# Altium schematic sheet RS485.SchDoc: NH Speaker Sensor 16CH 2.3_C
size A3; Revision: 2.3; SheetNumber: 3; SheetTotal: 6
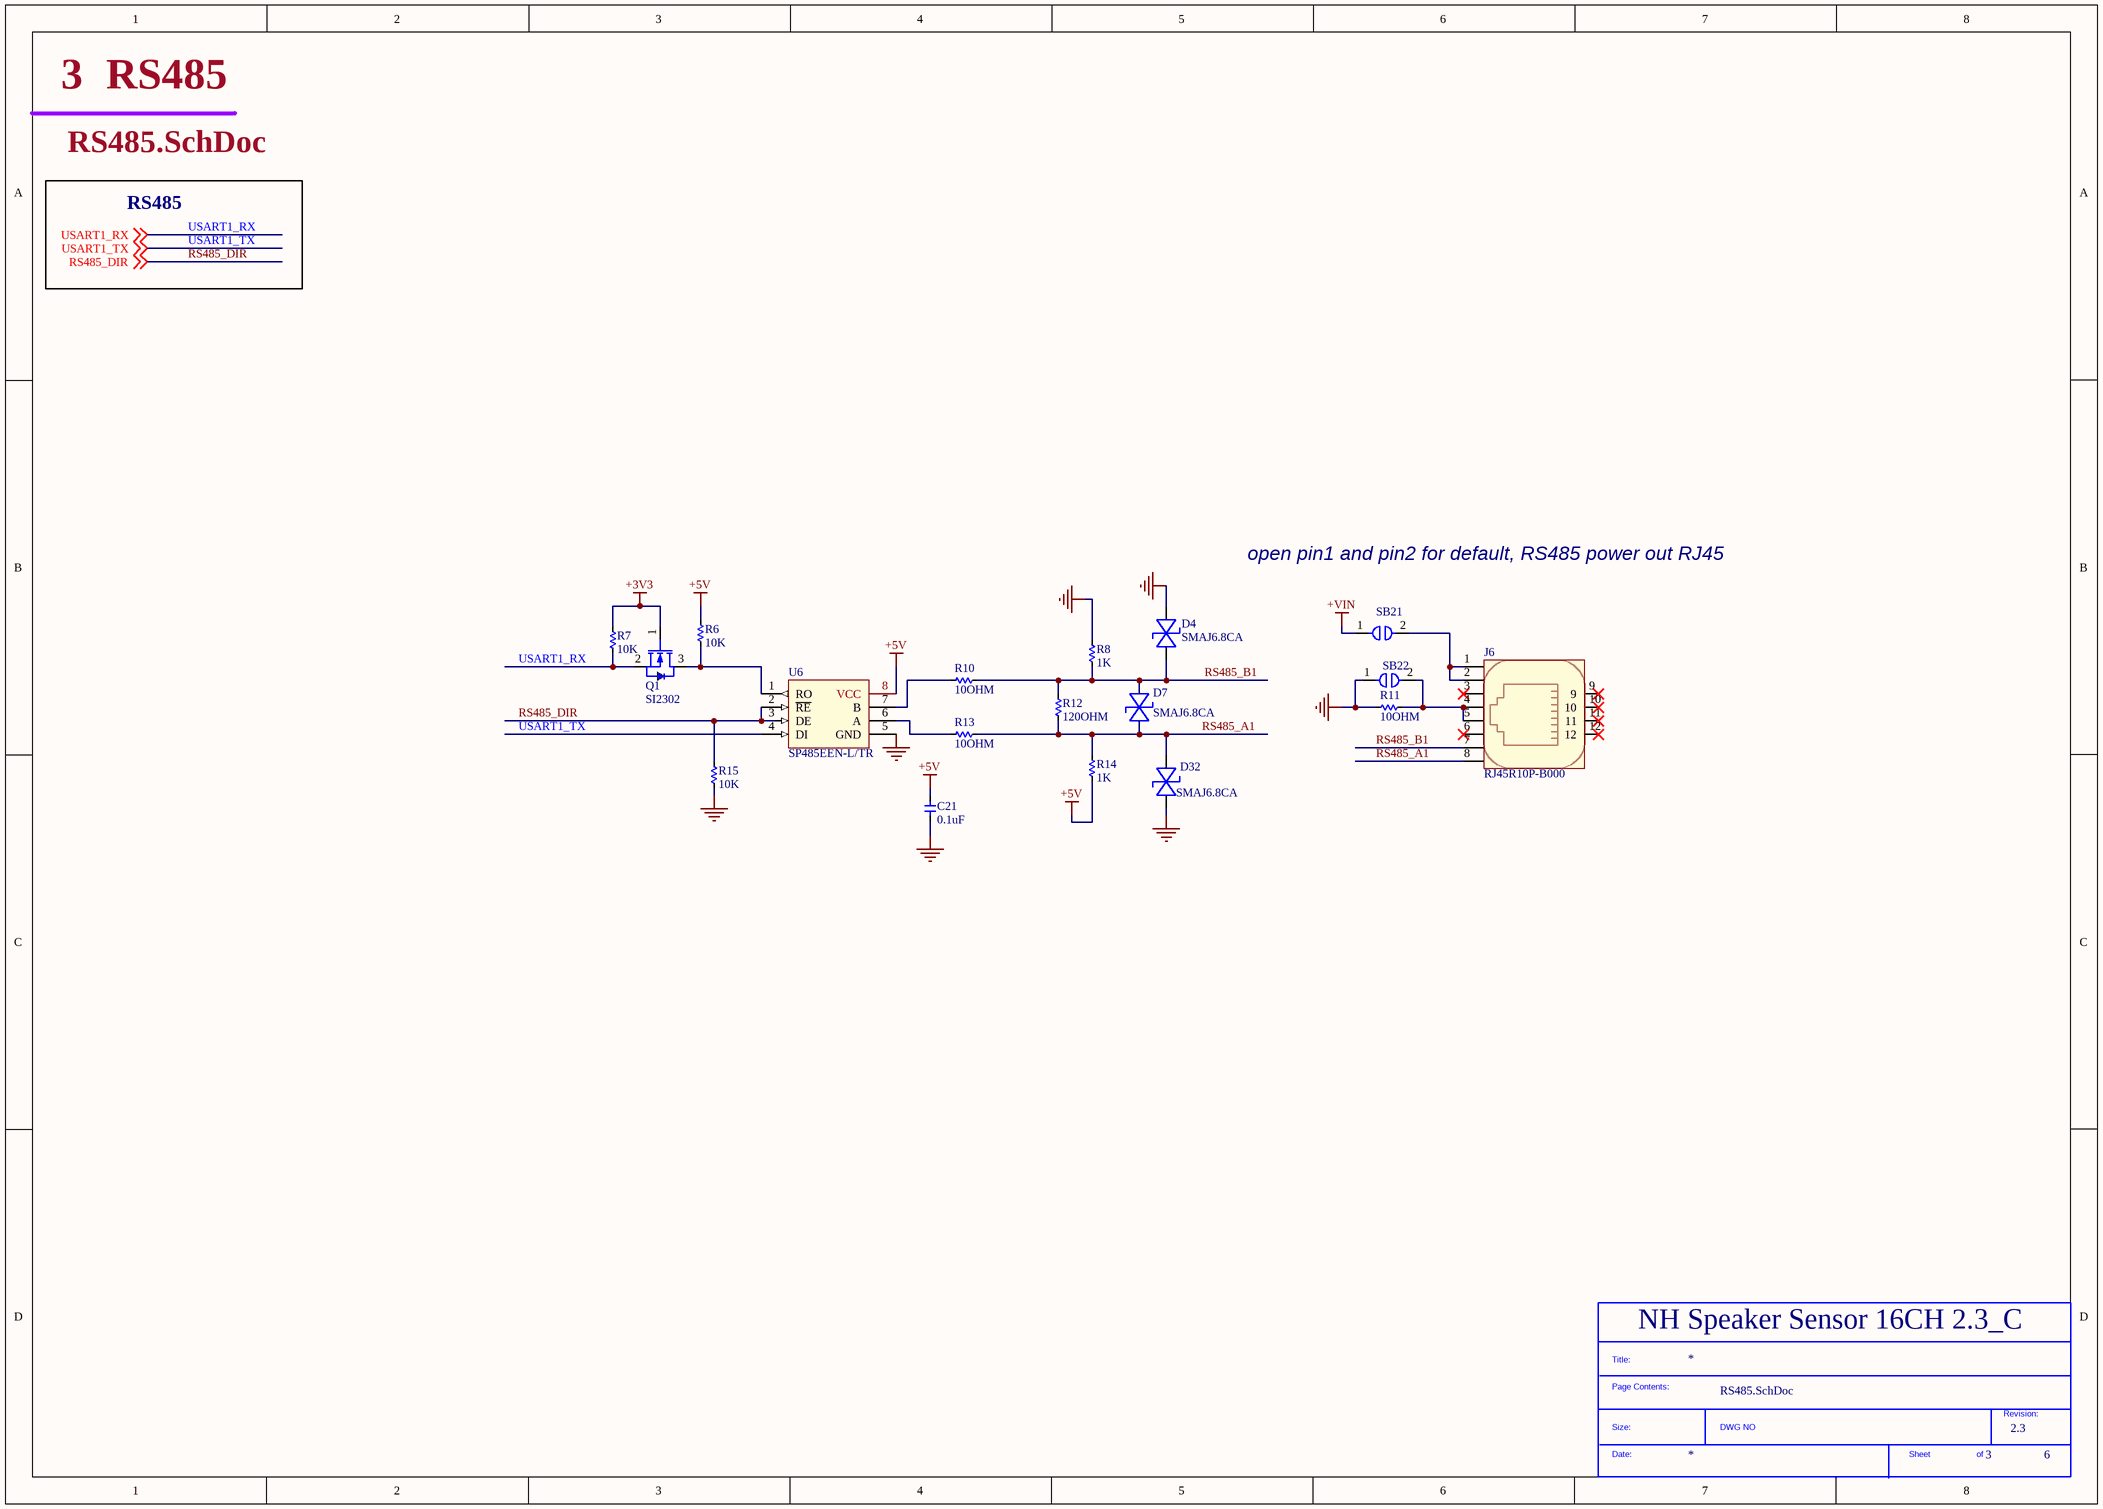
[diagram p0: RS485.SchDoc]

## Parts
*?  SDTitleBlock  (value not drawn)  (graphical)
C21  0.1uF  [C_0603]
D4  SMAJ6.8CA  [SMA,DO-214AC - CA]
D7  SMAJ6.8CA  [SMA,DO-214AC - CA]
D32  SMAJ6.8CA  [SMA,DO-214AC - CA]
J6  RJ45R10P-B000  [RJ45-TH_R-RJ45R10P-B000]
Q1  SI2302  [SOT-23-3_L2.9-W1.6-P1.90-LS2.8-BR]
R6  10K  [R_0603]
R7  10K  [R_0603]
R8  1K  [R_0603]
R10  10OHM  [R_0805]
R11  10OHM  [R_0603]
R12  120OHM  [R_0603]
R13  10OHM  [R_0805]
R14  1K  [R_0603]
R15  10K  [R_0603]
SB21  SOLDERJUMPER_1WAY  [SOLDERJUMPER_1WAY]  (value not drawn)  (no BOM)
SB22  SOLDERJUMPER_1WAY  [SOLDERJUMPER_1WAY]  (value not drawn)  (no BOM)
U6  SP485EEN-L/TR  [SOIC-8_3.9x4.9x1.27P]

## Nets
+3V3: Q1.1(G) R7.1
+5V: C21.2 R6.1 R14.2 U6.8(VCC)
+VIN: SB21.1
GND: C21.1 D4.1(A) D32.2(K) R8.1 R11.2 R15.2 SB22.1 U6.5(GND)
RS485_A1: D7.2(K) D32.1(A) J6.8 R12.2 R13.1 R14.1
RS485_B1: D4.2(K) D7.1(A) J6.7 R8.2 R10.1 R12.1
RS485_DIR: R15.1 U6.2(~{RE}) U6.3(DE) ; off-sheet RS485_DIR
USART1_RX: Q1.2(S) R7.2 ; off-sheet USART1_RX
USART1_TX: U6.4(DI) ; off-sheet USART1_TX
NetJ6_1: J6.1 J6.2 SB21.2
NetJ6_4: J6.4 J6.5 R11.1 SB22.2
NetQ1_3: Q1.3(D) R6.2 U6.1(RO)
NetR10_2: R10.2 U6.7(B)
NetR13_2: R13.2 U6.6(A)

Not connected (* = marked no-connect by the designer): J6 3* 6* 9* 10* 11* 12*

## Notes on the sheet
- RS485
- open pin1 and pin2 for default, RS485 power out RJ45
- (in symbol SDTitleBlock) Title:; Page Contents:; Revision:; Size:; DWG NO; Date:; Sheet; of

## Library data of the parts
*? = SDTitleBlock: TitleBlock
C21 = CC0603KRX7R9BB104: 100NF 50V 0603 ROHS; Manufacturer: YAGEO; Manufacturer Part Number: CC0603KRX7R9BB104; Package: 0603; LCSC Part Number: C14663; ComponentLink1Description: Digikey Link; ComponentLink1URL: https://www.digikey.com/en/products/detail/yageo/CC0603KRX7R9BB104/2103082?s=N4IgTCBcDaIMwEYEFoFwCzuWZA5AIiALoC%2BQA; ComponentLink2Description: LCSC Link; ComponentLink2URL: https://jlcpcb.com/parts/componentSearch?searchTxt=10k%200603; Assembly type: SMT Assembly
D4 D7 D32 = SMAJ6.8CA: Bidirectional 6.8V SMA(DO-214AC) TVS RoHS; Manufacturer: Bourne Semicon (Shenzhen); Manufacturer Part Number: SMAJ6.8CA; LCSC Part Number: C406209; Package: SMA,DO-214AC; Assembly Type: SMT Assembly
J6 = RJ45R10P-B000: RJ45 18MM, No Transformer; Manufacturer: Ckmtw(Shenzhen Cankemeng); Manufacturer Part Number: R-RJ45R10P-B000; LCSC Part Number: C386758; Package: Through hole; Assembly Type: Hand Soldering
Q1 = Si2302CDS-T1-GE3: MOSFET N TRENCH 20V 2.9A 850MV @ 250UA 57 M? @ 3.6A,4.5V SOT-23(SOT-23-3) ROHS; Manufacturer: Vishay Intertech; Manufacturer Part Number: Si2302CDS-T1-GE3; LCSC Part Number: C10488; Package: SOT-23-3; Assembly Type: SMT Assembly
R6 R7 R15 = 0603WAF1002T5E: 10KOHMS ±1% 1/10W 0603 ROHS; Manufacturer: Uniroyal Elec; Manufacturer Part Number: 0603WAF1002T5E; LCSC Part Number: C25804; Package: 0603; Assembly Type: SMT Assembly
R8 R14 = 0603WAF1001T5E: 1KOHMS ±1% 1/10W 0603 ROHS; Manufacturer: Uniroyal Elec; Manufacturer Part Number: 0603WAF1001T5E; LCSC Part Number: C21190; Package: 0603; Assembly Type: SMT Assembly
R10 R13 = 0805W8F100JT5E: 10OHMS ±1% 1/8W 0805 ROHS; Manufacturer: Uniroyal Elec; Manufacturer Part Number: 0805W8F100JT5E; LCSC Part Number: C17415; Package: 0805; Assembly Type: SMT Assembly
R11 = 0603WAF100JT5E: 10OHMS ±1% 1/10W 0603 ROHS; Manufacturer: Uniroyal Elec; Manufacturer Part Number: 0603WAF100JT5E; LCSC Part Number: C22859; Package: 0603; Assembly Type: SMT Assembly
R12 = 0603WAF1200T5E: 120OHMS ±1% 1/10W 0603 ROHS; Manufacturer: Uniroyal Elec; Manufacturer Part Number: 0603WAF1200T5E; Package: 0603; LCSC Part Number: C22787; Assembly Type: SMT Assembly
SB21 SB22 = SOLDERJUMPER_1WAY: GateName_1: G$1; SymbolName_1: SOLDERJUMPER_1WAY; LibraryName: microbuilder; DeviceSetName: SOLDERJUMPER_1WAY
U6 = SP485EEN-L/TR: RS-485 & RS-422 1/1 1MBPS 3.15V ~ 5.5V SOIC-8_150MIL ROHS; Manufacturer: MaxLinear; ComponentLink1URL: http://www.ti.com/lit/ds/symlink/sn65hvd1785.pdf?src-supplier=Digi-Key; ComponentLink1Description: http://www.ti.com/lit/ds/symlink/sn65hvd1785.pdf?src-supplier=Digi-Key; ComponentLink2URL: http://datasheet.iiic.cc/texas_instruments/SN65HVD1785DR.pdf?src-supplier=IIIC; ComponentLink2Description: http://datasheet.iiic.cc/texas_instruments/SN65HVD1785DR.pdf?src-supplier=IIIC; Manufacturer Part Number: SP485EEN-L/TR; LCSC Part Number: C6855; Package: SOIC-8_3.9x4.9x1.27P; Assembly Type: SMT Assembly